# Altium schematic sheet EBAZ4205扩展_连接.SchDoc
size A4; DocumentNumber: 4; SheetNumber: 1; SheetTotal: 4
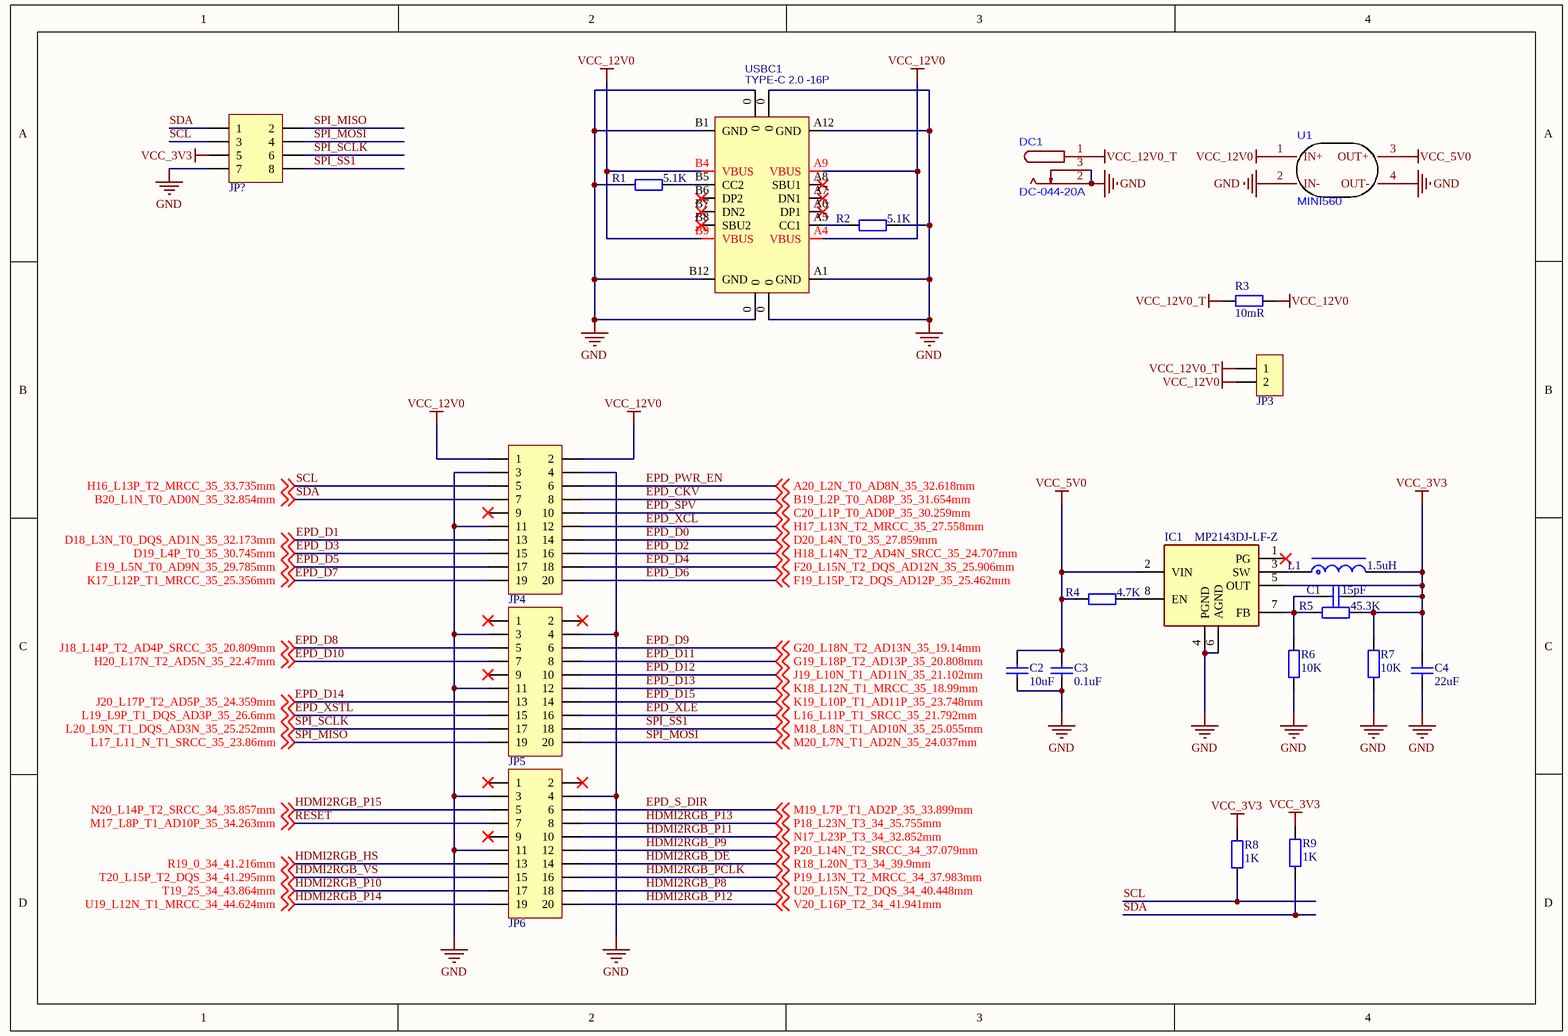
[diagram p0: EBAZ4205扩展_连接.SchDoc]

## Parts
C1  15pF  [C0402_L]
C2  10uF  [C0805_L]
C3  0.1uF  [C0402_L]
C4  22uF  [C0805_L]
DC1  DC-044-20A  [DC-IN-TH_DC-044-20A]
IC1  MP2143DJ-LF-Z  [SOP65P280X100-8N]
JP3  HDR-1X2  [HDR1.27-LI-2P]  (value not drawn)
JP4  Header 2X10  [PHD2.0-LI-2x10P]  (value not drawn)
JP5  Header 2X10  [PHD2.0-LI-2x10P]  (value not drawn)
JP6  Header 2X10  [PHD2.0-LI-2x10P]  (value not drawn)
JP?  Header 4X2  [HDR2.54-LI-2x4P]  (value not drawn)
L1  1.5uH  [NR3010]
R1  5.1K  [R0402_L]
R2  5.1K  [R0402_L]
R3  10mR  [R0805-HP_L]
R4  4.7K  [R0402_L]
R5  45.3K  [R0402_L]
R6  10K  [R0402_L]
R7  10K  [R0402_L]
R8  1K  [R0402_L]
R9  1K  [R0402_L]
U1  MINI560  [MINI560]
USBC1  TYPE-C 2.0 -16P  [USB-C-SMD_16P]

## Nets
GND: C2.1 C3.1 C4.1 DC1.2 DC1.3 IC1.4(PGND) IC1.6(AGND) JP4.3 JP4.4 JP4.11 JP5.3 JP5.4 JP5.11 JP6.3 JP6.4 JP6.11 JP?.7 R1.2 R2.1 R6.1 R7.1 U1.2(IN-) U1.4(OUT-) USBC1.0 USBC1.A1(GND) USBC1.A12(GND) USBC1.B1(GND) USBC1.B12(GND)
VCC_3V3: C1.1 C4.2 IC1.5(OUT) JP?.5 L1.2 R5.1 R7.2 R8.2 R9.2
VCC_5V0: C2.2 C3.2 IC1.2(VIN) R4.2 U1.3(OUT+)
VCC_12V0: JP3.2 JP4.1 JP4.2 R3.2 U1.1(IN+) USBC1.A4(VBUS) USBC1.A9(VBUS) USBC1.B4(VBUS) USBC1.B9(VBUS)
VCC_12V0_T: DC1.1 JP3.1 R3.1
EPD_CKV: JP4.8 ; off-sheet B19_L2P_T0_AD8P_35_31.654mm  [also labelled B19_L2P_T0_AD8P_35_31.654mm]
EPD_D0: JP4.14 ; off-sheet D20_L4N_T0_35_27.859mm  [also labelled D20_L4N_T0_35_27.859mm]
EPD_D1: JP4.13 ; off-sheet D18_L3N_T0_DQS_AD1N_35_32.173mm  [also labelled D18_L3N_T0_DQS_AD1N_35_32.173mm]
EPD_D2: JP4.16 ; off-sheet H18_L14N_T2_AD4N_SRCC_35_24.707mm  [also labelled H18_L14N_T2_AD4N_SRCC_35_24.707mm]
EPD_D3: JP4.15 ; off-sheet D19_L4P_T0_35_30.745mm  [also labelled D19_L4P_T0_35_30.745mm]
EPD_D4: JP4.18 ; off-sheet F20_L15N_T2_DQS_AD12N_35_25.906mm  [also labelled F20_L15N_T2_DQS_AD12N_35_25.906mm]
EPD_D5: JP4.17 ; off-sheet E19_L5N_T0_AD9N_35_29.785mm  [also labelled E19_L5N_T0_AD9N_35_29.785mm]
EPD_D6: JP4.20 ; off-sheet F19_L15P_T2_DQS_AD12P_35_25.462mm  [also labelled F19_L15P_T2_DQS_AD12P_35_25.462mm]
EPD_D7: JP4.19 ; off-sheet K17_L12P_T1_MRCC_35_25.356mm  [also labelled K17_L12P_T1_MRCC_35_25.356mm]
EPD_D8: JP5.5 ; off-sheet J18_L14P_T2_AD4P_SRCC_35_20.809mm  [also labelled J18_L14P_T2_AD4P_SRCC_35_20.809mm]
EPD_D9: JP5.6 ; off-sheet G20_L18N_T2_AD13N_35_19.14mm  [also labelled G20_L18N_T2_AD13N_35_19.14mm]
EPD_D10: JP5.7 ; off-sheet H20_L17N_T2_AD5N_35_22.47mm  [also labelled H20_L17N_T2_AD5N_35_22.47mm]
EPD_D11: JP5.8 ; off-sheet G19_L18P_T2_AD13P_35_20.808mm  [also labelled G19_L18P_T2_AD13P_35_20.808mm]
EPD_D12: JP5.10 ; off-sheet J19_L10N_T1_AD11N_35_21.102mm  [also labelled J19_L10N_T1_AD11N_35_21.102mm]
EPD_D13: JP5.12 ; off-sheet K18_L12N_T1_MRCC_35_18.99mm  [also labelled K18_L12N_T1_MRCC_35_18.99mm]
EPD_D14: JP5.13 ; off-sheet J20_L17P_T2_AD5P_35_24.359mm  [also labelled J20_L17P_T2_AD5P_35_24.359mm]
EPD_D15: JP5.14 ; off-sheet K19_L10P_T1_AD11P_35_23.748mm  [also labelled K19_L10P_T1_AD11P_35_23.748mm]
EPD_PWR_EN: JP4.6 ; off-sheet A20_L2N_T0_AD8N_35_32.618mm  [also labelled A20_L2N_T0_AD8N_35_32.618mm]
EPD_S_DIR: JP6.6 ; off-sheet M19_L7P_T1_AD2P_35_33.899mm  [also labelled M19_L7P_T1_AD2P_35_33.899mm]
EPD_SPV: JP4.10 ; off-sheet C20_L1P_T0_AD0P_35_30.259mm  [also labelled C20_L1P_T0_AD0P_35_30.259mm]
EPD_XCL: JP4.12 ; off-sheet H17_L13N_T2_MRCC_35_27.558mm  [also labelled H17_L13N_T2_MRCC_35_27.558mm]
EPD_XLE: JP5.16 ; off-sheet L16_L11P_T1_SRCC_35_21.792mm  [also labelled L16_L11P_T1_SRCC_35_21.792mm]
EPD_XSTL: JP5.15 ; off-sheet L19_L9P_T1_DQS_AD3P_35_26.6mm  [also labelled L19_L9P_T1_DQS_AD3P_35_26.6mm]
HDMI2RGB_DE: JP6.14 ; off-sheet R18_L20N_T3_34_39.9mm  [also labelled R18_L20N_T3_34_39.9mm]
HDMI2RGB_HS: JP6.13 ; off-sheet R19_0_34_41.216mm  [also labelled R19_0_34_41.216mm]
HDMI2RGB_P8: JP6.18 ; off-sheet U20_L15N_T2_DQS_34_40.448mm  [also labelled U20_L15N_T2_DQS_34_40.448mm]
HDMI2RGB_P9: JP6.12 ; off-sheet P20_L14N_T2_SRCC_34_37.079mm  [also labelled P20_L14N_T2_SRCC_34_37.079mm]
HDMI2RGB_P10: JP6.17 ; off-sheet T19_25_34_43.864mm  [also labelled T19_25_34_43.864mm]
HDMI2RGB_P11: JP6.10 ; off-sheet N17_L23P_T3_34_32.852mm  [also labelled N17_L23P_T3_34_32.852mm]
HDMI2RGB_P12: JP6.20 ; off-sheet V20_L16P_T2_34_41.941mm  [also labelled V20_L16P_T2_34_41.941mm]
HDMI2RGB_P13: JP6.8 ; off-sheet P18_L23N_T3_34_35.755mm  [also labelled P18_L23N_T3_34_35.755mm]
HDMI2RGB_P14: JP6.19 ; off-sheet U19_L12N_T1_MRCC_34_44.624mm  [also labelled U19_L12N_T1_MRCC_34_44.624mm]
HDMI2RGB_P15: JP6.5 ; off-sheet N20_L14P_T2_SRCC_34_35.857mm  [also labelled N20_L14P_T2_SRCC_34_35.857mm]
HDMI2RGB_PCLK: JP6.16 ; off-sheet P19_L13N_T2_MRCC_34_37.983mm  [also labelled P19_L13N_T2_MRCC_34_37.983mm]
HDMI2RGB_VS: JP6.15 ; off-sheet T20_L15P_T2_DQS_34_41.295mm  [also labelled T20_L15P_T2_DQS_34_41.295mm]
RESET: JP6.7 ; off-sheet M17_L8P_T1_AD10P_35_34.263mm  [also labelled M17_L8P_T1_AD10P_35_34.263mm]
SCL: JP4.5 JP?.3 R8.1 ; off-sheet H16_L13P_T2_MRCC_35_33.735mm  [also labelled H16_L13P_T2_MRCC_35_33.735mm]
SDA: JP4.7 JP?.1 R9.1 ; off-sheet B20_L1N_T0_AD0N_35_32.854mm  [also labelled B20_L1N_T0_AD0N_35_32.854mm]
SPI_MISO: JP5.19 JP?.2 ; off-sheet L17_L11_N_T1_SRCC_35_23.86mm  [also labelled L17_L11_N_T1_SRCC_35_23.86mm]
SPI_MOSI: JP5.20 JP?.4 ; off-sheet M20_L7N_T1_AD2N_35_24.037mm  [also labelled M20_L7N_T1_AD2N_35_24.037mm]
SPI_SCLK: JP5.17 JP?.6 ; off-sheet L20_L9N_T1_DQS_AD3N_35_25.252mm  [also labelled L20_L9N_T1_DQS_AD3N_35_25.252mm]
SPI_SS1: JP5.18 JP?.8 ; off-sheet M18_L8N_T1_AD10N_35_25.055mm  [also labelled M18_L8N_T1_AD10N_35_25.055mm]
NetC1_2: C1.2 IC1.7(FB) R5.2 R6.2
NetIC1_3: IC1.3(SW) L1.1
NetIC1_8: IC1.8(EN) R4.1
NetR1_1: R1.1 USBC1.B5(CC2)
NetR2_2: R2.2 USBC1.A5(CC1)

Not connected (* = marked no-connect by the designer): IC1 1(PG)*; JP4 9*; JP5 1* 2* 9*; JP6 1* 2* 9*; USBC1 A6(DP1)* A7(DN1)* A8(SBU1)* B6(DP2)* B7(DN2)* B8(SBU2)*

## Library data of the parts
C1-C4 = C: 贴片电容; BOM名称: 无极性贴片电容; 联系卖家，免费查找封装: 唯一出售店铺网址https://shop463601444.taobao.com
IC1 = MP2143DJ-LF-Z: Integrated Circuit; Manufacturer_Name: Monolithic Power Systems (MPS); Datasheet Link: https://www.mouser.com/ds/2/277/MP2143_r1.07-371732.pdf; Height: 1mm; Manufacturer_Part_Number: MP2143DJ-LF-Z; Mouser Part Number: 946-MP2143DJLFZ; Mouser Price/Stock: https://www.mouser.co.uk/ProductDetail/Monolithic-Power-Systems-MPS/MP2143DJ-LF-Z?qs=QEkzKklKf2Sh6e0cSbvEyA%3D%3D
JP3 = Header 2: 2P接插件; 版权归属: 源创客; BOM名称: 2P接插件; 学习资源: www.ooocke.com
JP4-JP6 = Header 10X2: 10*2P接插件; 封装库来自淘宝卖家 ID：黄晶宝石: 其他店铺购入均为盗版，不享受售后技术支持服务，请立即申请退款
JP? = Header 4X2: 4*2P接插件; 封装库来自淘宝卖家 ID：黄晶宝石: 其他店铺购入均为盗版假冒封装库; 联系卖家，免费查找封装: 唯一出售店铺网址https://shop463601444.taobao.com; BOM名称: 4*2P接插件
L1 = L-NR: 太诱-NR磁胶电感; 0.0_BOM名称: NR磁胶电感; 3.交流分享: Q群514746572,开源更新,欢迎一起交流学习PCB设计; 4.作者声明: 旨为整合最全库集,欢迎转载,禁止商用！-冰凌猫; 5.备注说明: 该库已二次整合过网上各热销库,基本最全,无需重复搜购安装; 1.库作者: 冰凌猫; 2.库版本: v2.0 (2021.03.30)
R1 R2 R4-R9 = R: 贴片电阻; 联系卖家，免费查找封装: 唯一出售店铺网址https://shop463601444.taobao.com; 封装库来自淘宝卖家ID：黄晶宝石: 其他店铺购入均为盗版假冒封装库，请立即申请退款; BOM名称: 贴片电阻
R3 = R-High Precision: 贴片精密电阻; BOM名称: 精密电阻; 联系卖家，免费查找封装: 唯一出售店铺网址https://shop463601444.taobao.com; 封装库来自淘宝卖家ID：黄晶宝石: 其他店铺购入均为盗版假冒封装库，请立即申请退款
USBC1 = USB2.0_Type-C_16Pin: USB2.0 Type-C 16Pin  母座; 联系卖家，免费技术支持: 唯一出售店铺网址https://shop463601444.taobao.com